# EasyEDA Pro project 残肢辅助输入设备.epro

# Schematic Schematic1_1
Board Name: Board1; Create Date: 2025-11-10; Page Name: P1; Project Name: 残值辅助输入设备; Schematic Name: Schematic1; Update Date: 2025-11-10; BladeWidth: 10; Company: 嘉立创EDA; Page Size: A4; RegionStart: 1; ShowBorder: 1; TitleBlock: 1; TitleBlockPosition: 3; Version: V1.0; XRegionCount: 6; YRegionCount: 4
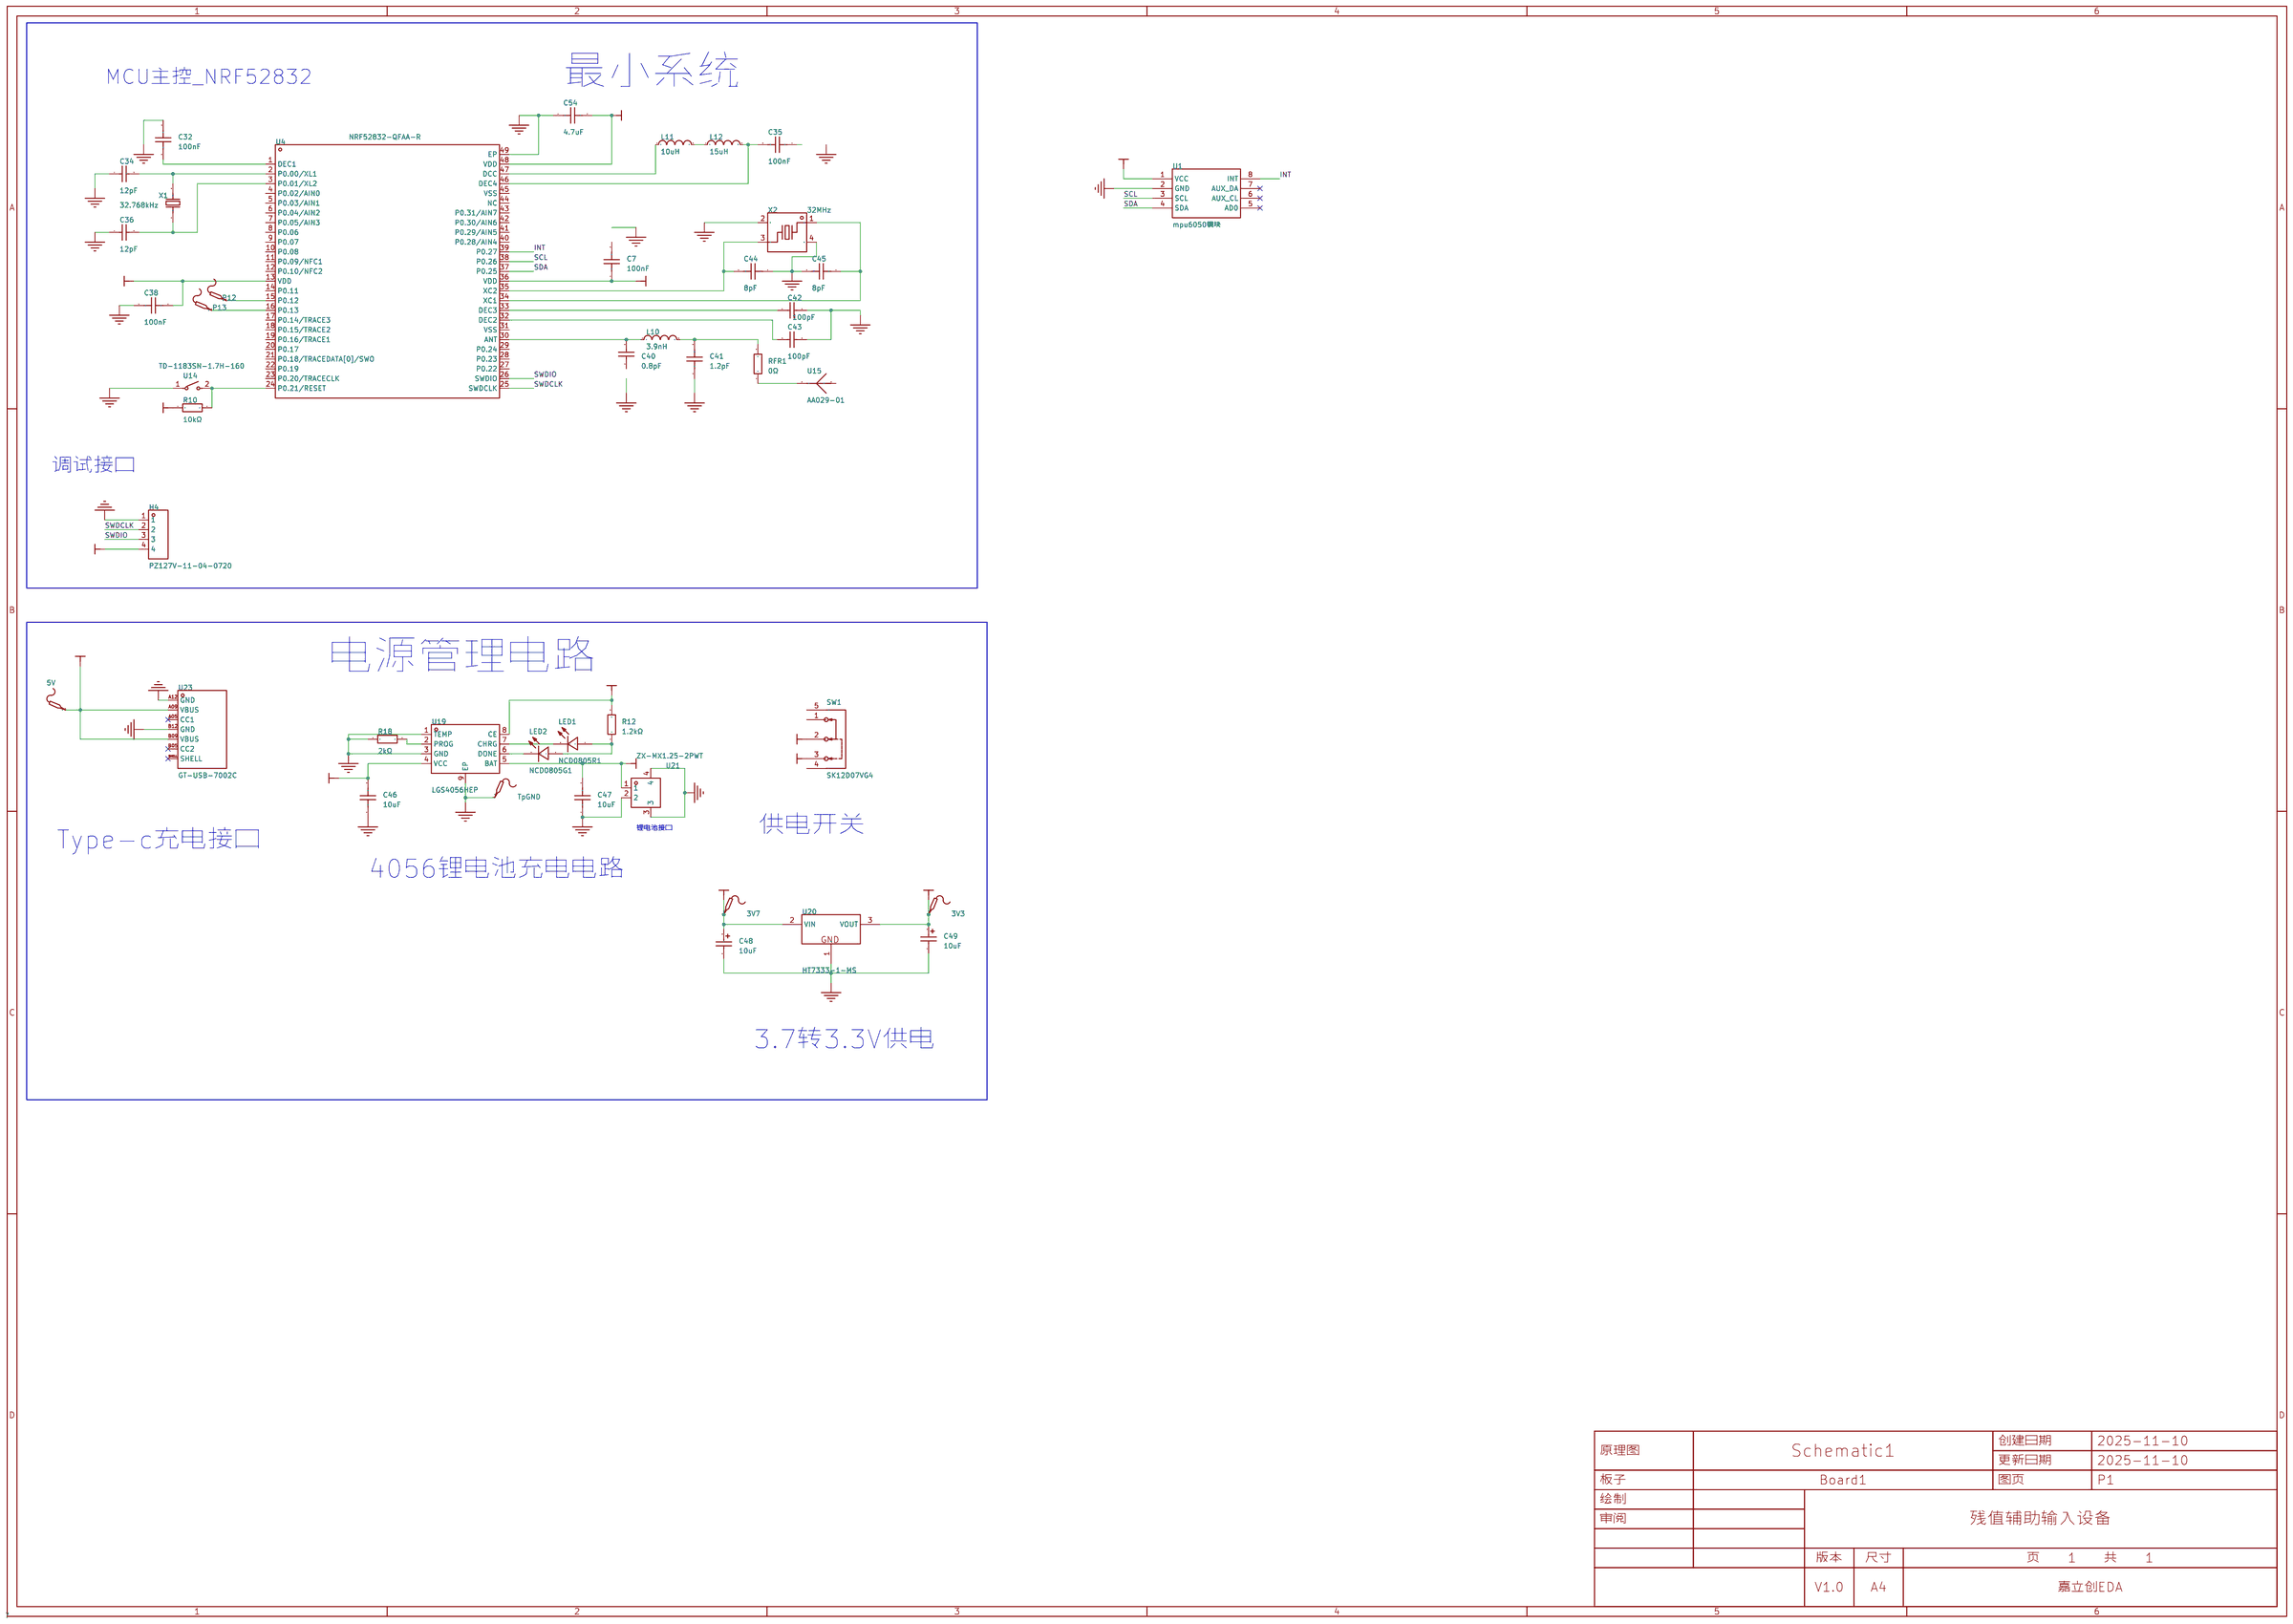
[diagram p0: schematic sheet]

## Parts
3V3  -  [Test-Point-0.5mm]
3V7  -  [Test-Point-0.5mm]
5V  -  [Test-Point-0.5mm]
C7  100nF  [C0402]
C32  100nF  [C0402]
C34  12pF  [C0402]
C35  100nF  [C0402]
C36  12pF  [C0402]
C38  100nF  [C0402]
C40  0.8pF  [C0402]
C41  1.2pF  [C0402]
C42  100pF  [C0402]
C43  100pF  [C0402]
C44  8pF  [C0402]
C45  8pF  [C0402]
C46  10uF  [C0603]
C47  10uF  [C0603]
C48  10uF  [CAP-SMD_L3.2-W1.6-RD]
C49  10uF  [CAP-SMD_L3.2-W1.6-RD]
C54  4.7uF  [C0402]
H4  PZ127V-11-04-0720  [HDR-TH_4P-P1.27-V-M]
L10  3.9nH  [L0603]
L11  10uH  [L0603]
L12  15uH  [L0603]
LED1  NCD0805R1  [LED0805-R-RD]
LED2  NCD0805G1  [LED0805-R-RD]
P12  -  [Test-Point-0.5mm]
P13  -  [Test-Point-0.5mm]
R10  10kΩ  [R0603]
R12  1.2kΩ  [R0603]
R18  2kΩ  [R0603]
RFR1  0Ω  [R0402]
SW1  SK12D07VG4  [SW-TH_SK12D07VG4]
TpGND  -  [Test-Point-0.5mm]
U1  mpu6050模块  [mpu6050模块]
U4  NRF52832-QFAA-R  [QFN-48_L6.0-W6.0-P0.40-BL-EP3.8]
U14  TD-1183SN-1.7H-160  [KEY-SMD_L3.0-W2.5-LS4.0_TD-1183SN]
U15  AA029-01  [ANT-SMD_L5.0-W2.2]
U19  LGS4056HEP  [ESOP-8_L4.9-W3.9-P1.27-LS6.0-BL-EP-1]
U20  HT7333-1-MS  [SOT-89-3_L4.5-W2.5-P1.50-LS4.2-BR]
U21  ZX-MX1.25-2PWT  [CONN-SMD_2P-P1.25_MEGASTAR_ZX-MX1.25-2PWT]
U23  GT-USB-7002C  [USB-C-SMD_GT-USB-7002C]
X1  32.768kHz  [FC-135R_L3.2-W1.5]
X2  32MHz  [CRYSTAL-SMD_4P-L2.0-W1.6-BL]

## Library data of the parts
3V3 3V7 5V P12 P13 TpGND = Test-Point: Test Point 测试点
C7 C32 C35 C38 = CL05B104KB54PNC: 容值:100nF;精度:±10%;额定电压:50V;材质(温度系数):X7R;; LCSC Part Name: 100nF ±10% 50V; Supplier Part: C307331; Manufacturer: SAMSUNG(三星); Supplier Footprint: 0402; JLCPCB Part Class: 基础库; Datasheet: https://atta.szlcsc.com/upload/public/pdf/source/20160218/1457707763339.pdf; Supplier: LCSC; Tolerance: ±10%; Voltage Rated: 50V; Temperature Coefficient: X7R
C34 C36 = 0402CG120J500NT: 容值:12pF;精度:±5%;额定电压:50V;温度系数:C0G;; LCSC Part Name: 12pF ±5% 50V; Supplier Part: C1547; Manufacturer: FH(风华); Supplier Footprint: 0402; JLCPCB Part Class: 基础库; Datasheet: https://item.szlcsc.com/datasheet/0402CG120J500NT/1899.html; Supplier: LCSC; Tolerance: ±5%; Voltage Rating: 50V; Temperature Coefficient: C0G
C40 = GJM1555C1HR80BB01D: 容值:0.8pF;额定电压:50V;温度系数:C0G;; LCSC Part Name: ±0.1pF 0.8pF 50V; Supplier Part: C76915; Manufacturer: muRata(村田); Supplier Footprint: 0402; JLCPCB Part Class: 扩展库; Datasheet: https://atta.szlcsc.com/upload/public/pdf/source/20180307/C76915_15204090825531407705.pdf; Supplier: LCSC; Voltage Rating: 50V; Temperature Coefficient: C0G
C41 = GJM1555C1H1R2BB01D: 容值:1.2pF;额定电压:50V;温度系数:-;; LCSC Part Name: ±0.1pF 1.2pF 50V; Supplier Part: C72135; Manufacturer: muRata(村田); Supplier Footprint: 0402; JLCPCB Part Class: 扩展库; Datasheet: https://atta.szlcsc.com/upload/public/pdf/source/20161108/1478586455030.pdf; Supplier: LCSC; Voltage Rating: 50V
C42 C43 = 0402CG101J500NT: 容值:100pF;精度:±5%;额定电压:50V;材质(温度系数):C0G;; LCSC Part Name: 100pF ±5% 50V; Supplier Part: C1546; Manufacturer: FH(风华); Supplier Footprint: 0402; JLCPCB Part Class: 基础库; Datasheet: https://atta.szlcsc.com/upload/public/pdf/source/20200305/C486355_26A10D38EF8C2A5C37091D0039909270.pdf; Supplier: LCSC; Tolerance: ±5%; Voltage Rated: 50V; Temperature Coefficient: C0G
C44 C45 = CC0402BRNPO9BN8R0: 容值:8pF;额定电压:50V;材质(温度系数):NP0;; LCSC Part Name: 8pF 50V ±0.1pF; Supplier Part: C281765; Manufacturer: YAGEO(国巨); Supplier Footprint: 0402; JLCPCB Part Class: 扩展库; Datasheet: https://atta.szlcsc.com/upload/public/pdf/source/20181008/C309499_21CC21451B82C39E3D92150FD6B30293.pdf; Supplier: LCSC; Voltage Rated: 50V; Temperature Coefficient: NP0
C46 C47 = CGA0603X5R106K100JT: 容值:10uF;精度:±10%;额定电压:10V;温度系数:X5R;; LCSC Part Name: 10uF ±10% 10V; Supplier Part: C6119842; Manufacturer: HRE(芯声); Supplier Footprint: 0603; JLCPCB Part Class: Extended Part; Supplier: LCSC; Tolerance: ±10%; Voltage Rating: 10V; Temperature Coefficient: X5R
C48 C49 = CA45-A-16V-10uF-K: 容值:10uF;精度:±10%;额定电压:16V;等效串联电阻:10Ω@100kHz;; LCSC Part Name: 10uF ±10% 16V; Supplier Part: C128254; Manufacturer: CEC(振华新云); Supplier Footprint: CASE-A-3216; JLCPCB Part Class: Extended Part; Datasheet: https://atta.szlcsc.com/upload/public/pdf/source/20170914/C128254_1505359752472967905.pdf; Supplier: LCSC; Tolerance: ±10%; Rated Voltage: 16V; Equivalent Series Resistance(ESR): 10Ω@100kHz; Operating Temperature: -55℃~+125℃
C54 = CL05A475MP5NRNC: 容值:4.7uF;精度:±20%;额定电压:10V;温度系数:X5R;; LCSC Part Name: 4.7uF ±20% 10V; Supplier Part: C23733; Manufacturer: SAMSUNG(三星); Supplier Footprint: 0402; JLCPCB Part Class: 基础库; Datasheet: https://item.szlcsc.com/datasheet/CL05A475MP5NRNC/24469.html; Supplier: LCSC; Tolerance: ±20%; Voltage Rating: 10V; Temperature Coefficient: X5R
H4 = PZ127V-11-04-0720: 插针结构:1x4P;间距:1.27mm;行距:-;圆针/方针:-;安装类型:直插;排数:单排;总PIN位数:4P;额定电流:-;额定电压:-;配合针长度:3.9mm;塑高:1mm;端接针长度:2.3mm;触头材质:黄铜;触头镀层:-;工作温度范围:-40℃~+105℃;焊接温度(最大值):-;颜色:黑色;; LCSC Part Name: 间距:1.27mm 1x4P 直插; Supplier Part: C541879; Manufacturer: XFCN(兴飞); Supplier Footprint: 插件,P=1.27mm; JLCPCB Part Class: 扩展库; Datasheet: https://atta.szlcsc.com/upload/public/pdf/source/20200519/C541879_5CD99C402ABEE613587AE88FBA356357.pdf; Supplier: LCSC; Pin Structure: 1x4P; Pitch: 1.27mm; Mounting Type: 直插; Number of Rows: 单排; Number of Pins: 4P; Length of Mating Pin: 3.9mm; Insulation Height: 1mm; Length of End Connection Pin: 2.3mm; Contact Material: 黄铜; Operating Temperature Range: -40℃~+105℃; Color: 黑色
L10 = SCC1608C3N9SSP: 电感值:3.9nH;额定电流:500mA;饱和电流(Isat):-;直流电阻(DCR):200mΩ;; Supplier Part: C412029; Manufacturer: Sunltech(顺磁); Supplier Footprint: 0603; JLCPCB Part Class: Extended Part; Datasheet: https://item.szlcsc.com/datasheet/SCC1608C3N9SSP/403522.html; Supplier: LCSC; Rated Current: 500mA; DC Resistance (DCR): 200mΩ; Current Rating: 500mA; DC Resistance(DCR): 200mΩ
L11 = MCL1608S100MT: 电感值:10uH;精度:±20%;额定电流:50mA;饱和电流(Isat):-;直流电阻(DCR):1.17Ω;; LCSC Part Name: 10uH ±20%; Supplier Part: C51942; Manufacturer: Sunlord(顺络); Supplier Footprint: 0603; JLCPCB Part Class: Extended Part; Datasheet: https://atta.szlcsc.com/upload/public/pdf/source/20241120/F98A73BCE98B3F58AF96E60C5F2B82D5.pdf; Supplier: LCSC; Tolerance: ±20%; Current Rating: 50mA; DC Resistance(DCR): 1.17Ω; Frequency - Self Resonant: 20MHz
L12 = MLF1608C150KTA00: 电感值:15uH;精度:±10%;额定电流:2mA;饱和电流(Isat):-;直流电阻(DCR):800mΩ;; LCSC Part Name: 15uH ±10%; Supplier Part: C275348; Manufacturer: TDK; Supplier Footprint: 0603; JLCPCB Part Class: Extended Part; Datasheet: https://atta.szlcsc.com/upload/public/pdf/source/20190108/C360705_7DAD0626EF1D2E0E828DA1C0F9238173.pdf; Supplier: LCSC; Tolerance: ±10%; Rated Current: 2mA; DC Resistance (DCR): 800mΩ; Q @ Freq: 20@1MHz; Frequency - Self Resonant: 22MHz
LED1 = NCD0805R1: 灯头类型:-;发光颜色:红色;正向电压(VF):1.6V~2.6V;功率:65mW;正向电流:20mA;主波长:615nm~630nm;二极管配置:独立二极管;透镜颜色:无色透明透镜;色温:-;发光强度:67mcd~195mcd;发光角度:130°;载带方式:-;工作温度:-30℃~+85℃;; Supplier Part: C84256; Manufacturer: 国星光电; Supplier Footprint: 0805; JLCPCB Part Class: Basic Part; Datasheet: https://atta.szlcsc.com/upload/public/pdf/source/20200820/C84256_F0A75A43B3EAD75808600A0514C76B99.pdf; Supplier: LCSC; Emitted Color: 红色; Forward Voltage (VF): 1.6V~2.6V; Power Dissipation: 65mW; Forward Current: 20mA; Dominant Wavelength: 615nm~630nm; Diode Configuration: 独立二极管; Lens Color: 无色透明透镜; Luminous Intensity: 67mcd~195mcd; Viewing Angle: 130°; Operating Temperature: -30℃~+85℃
LED2 = NCD0805G1: 灯头类型:-;发光颜色:绿色;正向压降(Vf):2.5V~3.6V;功率:72mW;正向电流:20mA;波长:525nm~537.5nm;二极管配置:-;透镜颜色:-;色温:-;发光强度:400mcd;发光角度:130°;载带方式:-;工作温度:-30℃~+85℃;; LCSC Part Name: 片式发光二极管; Supplier Part: C84260; Manufacturer: 国星光电; Supplier Footprint: 0805; JLCPCB Part Class: Extended Part; Datasheet: https://item.szlcsc.com/datasheet/NCD0805G1/85429.html; Supplier: LCSC; Illumination Color: 绿色; Voltage - Forward(Vf): 2.5V~3.6V; Power(Watts): 72mW; Forward Current: 20mA; Wavelength - Dominant: 525nm~537.5nm; Peak Wavelength: 520nm; Luminous Intensity: 400mcd; Viewing Angle: 130°; Operating Temperature: -30℃~+85℃
R10 = 0603WAF1002T5E: 电阻类型:厚膜电阻;阻值:10kΩ;精度:±1%;功率:100mW;最大工作电压:75V;温度系数:±100ppm/℃;; LCSC Part Name: 厚膜电阻 10kΩ ±1% 100mW; Supplier Part: C25804; Manufacturer: UNI-ROYAL(厚声); Supplier Footprint: 0603; JLCPCB Part Class: Basic Part; Datasheet: https://atta.szlcsc.com/upload/public/pdf/source/20200306/C422600_1E6D84923E4A46A82E41ADD87F860B5C.pdf; Supplier: LCSC; Type: 厚膜电阻; Tolerance: ±1%; Power(Watts): 100mW; Overload Voltage (Max): 75V; Temperature Coefficient: ±100ppm/℃; Operating Temperature Range: -55℃~+155℃
R12 = 0603WAF1201T5E: 电阻类型:厚膜电阻;阻值:1.2kΩ;精度:±1%;功率:100mW;工作电压:75V;温度系数:±100ppm/℃;; LCSC Part Name: 1.2kΩ ±1% 100mW 厚膜电阻; Supplier Part: C22765; Manufacturer: UNI-ROYAL(厚声); Supplier Footprint: 0603; JLCPCB Part Class: Basic Part; Datasheet: https://item.szlcsc.com/datasheet/0603WAF1201T5E/23492.html; Supplier: LCSC; Type: 厚膜电阻; Tolerance: ±1%; Power(Watts): 100mW; Voltage-Supply(Max): 75V; Temperature Coefficient: ±100ppm/℃; Operating Temperature: -55℃~+155℃
R18 = 0603WAF2001T5E: 电阻类型:厚膜电阻;阻值:2kΩ;精度:±1%;功率:100mW;工作电压:75V;温度系数:±100ppm/℃;; LCSC Part Name: 2kΩ ±1% 100mW 厚膜电阻; Supplier Part: C22975; Manufacturer: UNI-ROYAL(厚声); Supplier Footprint: 0603; JLCPCB Part Class: Basic Part; Datasheet: https://item.szlcsc.com/datasheet/0603WAF2001T5E/23702.html; Supplier: LCSC; Type: 厚膜电阻; Tolerance: ±1%; Power(Watts): 100mW; Voltage-Supply(Max): 75V; Temperature Coefficient: ±100ppm/℃; Operating Temperature: -55℃~+155℃
RFR1 = 0402WGF0000TCE: 电阻类型:厚膜电阻;阻值:0Ω;精度:±1%;功率:62.5mW;最大工作电压:50V;温度系数:±800ppm/℃;; LCSC Part Name: 0Ω ±1% 62.5mW 厚膜电阻; Supplier Part: C17168; Manufacturer: UNI-ROYAL(厚声); Supplier Footprint: 0402; JLCPCB Part Class: 基础库; Datasheet: https://atta.szlcsc.com/upload/public/pdf/source/20200306/C422600_1E6D84923E4A46A82E41ADD87F860B5C.pdf; Supplier: LCSC; Type: 厚膜电阻; Tolerance: ±1%; Power(Watts): 62.5mW; Overload Voltage (Max): 50V; Temperature Coefficient: ±800ppm/℃; Operating Temperature Range: -55℃~+155℃
SW1 = SK12D07VG4: 电路结构:单刀双掷;安装方式:-;额定电流:500mA;额定电压:50V;工作寿命:5千次;; LCSC Part Name: 3脚2档位 卧插 滑动开关; Supplier Part: C393937; Manufacturer: SHOU HAN(首韩); Supplier Footprint: 插件; JLCPCB Part Class: Extended Part; Datasheet: https://item.szlcsc.com/datasheet/SK12D07VG4/372549.html; Supplier: LCSC; Circuit: 单刀双掷; Actuator Style: 矩形柱状; Termination Style: PC引脚; Switch Height: 8.8mm; Current Rating: 500mA; Voltage Rating: 50V; Life: 5千次
U1 = mpu6050模块: 模块
U4 = NRF52832-QFAA-R: 频率范围:-;接口:I2C,SPI,UART;应用领域:IoT；蓝牙;数据速率:2Mbps;灵敏度:-96dBm;典型应用频率:2.4GHz;; Supplier Part: C77540; Manufacturer: NORDIC; Supplier Footprint: QFN-48-EP(6x6); JLCPCB Part Class: 扩展库; Datasheet: https://atta.szlcsc.com/upload/public/pdf/source/20191122/C77540_B22384C9419DF4416C7889F27174782C.pdf; Supplier: LCSC; Interface: I2C,SPI,UART; Operating Voltage: 1.7V~3.6V; Applications: IoT；蓝牙; Output Power: 4dBm; Data Rate: 2Mbps; Current Of Transmitting: 5.3mA; Sensitivity: -96dBm; Receive Current: 5.4mA; Typical Application Frequency: 2.4GHz; Operating Temperature: -40℃~+85℃
U14 = TD-1183SN-1.7H-160: LCSC Part Name: 小型正按轻触开关无柱 160gf H1.8; Supplier Part: C2905194; Manufacturer: DEALON(德艺隆); Supplier Footprint: SMD,2.5x3mm; Datasheet: https://atta.szlcsc.com/upload/public/pdf/source/20220901/772BB2D221624A1B1D046B52884053DD.pdf; Supplier: LCSC
U15 = AA029-01: LCSC Part Name: LXC(连兴创)AA029-陶瓷SMT天线; Supplier Part: C42379503; Manufacturer: LXC(连兴创); JLCPCB Part Class: 扩展库; Datasheet: https://atta.szlcsc.com/upload/public/pdf/source/20241122/407659FD5BCA78606BE7392D97FF646F.pdf; Supplier: LCSC
U19 = LGS4056HEP: 工作电压:4V~6V;最大充电电流:1A;电池类型:锂离子/聚合物;电池节数:1;; LCSC Part Name: TP4056H; Supplier Part: C5123970; Manufacturer: Legend-Si(棱晶半导体); Supplier Footprint: ESOP-8; JLCPCB Part Class: Extended Part; Datasheet: https://item.szlcsc.com/datasheet/LGS4056HEP/5718437.html; Supplier: LCSC; The Chip Type: 充电芯片; Voltage - Supply: 4V~6V; Charge Current - Max: 1A; Charging Saturation Voltage: 4.2V; Type of Battery: 锂离子/聚合物; Number of Cells: 1; Operating Temperature: -40℃~+85℃; Battery Temperature Detection: 支持; 0V Battery Charge: 支持; Supply Current (Iq): 150uA
U20 = HT7333-1-MS_C7434186: 输出类型:固定;工作电压:24V;输出电压:3.3V;输出电流:300mA;输出极性:正极;; LCSC Part Name: 低压差线性稳压器; Supplier Part: C7434186; Manufacturer: MSKSEMI(美森科); Supplier Footprint: SOT-89; JLCPCB Part Class: Extended Part; Datasheet: https://item.szlcsc.com/datasheet/HT7333-1-MS/8445362.html; Supplier: LCSC; Output Type: 固定; Voltage - Supply: 24V; Output Voltage: 3.3V; Output Current: 300mA; Voltage Dropout: 90mV@(40mA); standby current: 1.5uA; Operating Temperature: -35℃~+80℃@(Ta); Output Configuration: 正极; Number of Outputs: 1
U21 = ZX-MX1.25-2PWT: 插针结构:1x2P;间距:1.25mm;安装方式:卧贴;参考系列:PicoBlade(MX 1.25);总PIN数:2P;排数:1;每排PIN数:2;行距:-;额定电流:1A;触头材质:黄铜;触头镀层:锡;工作温度:-25℃~+85℃;; LCSC Part Name: 1x2P 间距:1.25mm 卧贴 系列:PicoBlade(MX 1.25); Supplier Part: C7430468; Manufacturer: Megastar(兆星); Supplier Footprint: SMD,P=1.25mm,卧贴; JLCPCB Part Class: Extended Part; Datasheet: https://item.szlcsc.com/datasheet/ZX-MX1.25-2PWT/8430337.html; Supplier: LCSC; Pins Structure: 1x2P; Pitch: 1.25mm; Mounting Type: 卧贴; Reference Series: PicoBlade(MX 1.25); Number of Pins: 2P; Number of Rows: 1; Number of PINs Per Row: 2; Current Rating: 1A; Contact Material: 黄铜; Contact Plating: 锡; Operating Temperature: -25℃~+85℃; Voltage Rating: 125V; Plastic Material: LCP; Supplementary Features: 辅助焊脚; Color: 米色; Z-Height of the Board: 3.6mm; X-Length of Bottom Edge on Board (Spacing Line): 7.5mm; Y-Width of Bottom Edge on Board: 5.25mm
U23 = GT-USB-7002C: 连接器类型:Type-C;协议标准:USB 2.0;公母:母;安装方式:卧贴;触点数量:6P;端口数量:1;额定电流 - 电源:-;工作温度:-40℃~+85℃;; LCSC Part Name: Type-C 母 卧贴; Supplier Part: C5117884; Manufacturer: G-Switch(品赞); Supplier Footprint: SMD; JLCPCB Part Class: Extended Part; Datasheet: https://item.szlcsc.com/datasheet/GT-USB-7002C/5694740.html; Supplier: LCSC; Connector Type: Type-C; Protocol Standard: USB 2.0; Gender: 母; Mounting Type: 卧贴; Number of Contacts: 6P; Number of Ports: 1; Connect-Disconnect Life: 1万次; Center Height: 1.65mm; Length: 6.8mm; Detection color: 黑色; Operating Temperature: -40℃~+85℃
X1 = Q13FC13500004_C32346: 晶振类型:贴片晶振;频率:32.768kHz;常温频差:±20ppm;负载电容:12.5pF;; LCSC Part Name: 32.768kHz ±20ppm 12.5pF; Supplier Part: C32346; Manufacturer: EPSON(爱普生); Manufacturer Part: Q13FC13500004; Supplier Footprint: SMD3215-2P; JLCPCB Part Class: 基础库; Datasheet: https://atta.szlcsc.com/upload/public/pdf/source/20240418/0E0FF5F0356BA3753F616001439D1416.pdf; Supplier: LCSC; Crystal Type: 贴片晶振; Normal temperature Frequency Tolerance: ±20ppm; Load Capacitor: 12.5pF; Equivalent Series Resistance (ESR): 70kΩ; Operating Temperature: -40℃~+85℃
X2 = XL7EL89CKI-111YLC-32M: 晶振类型:贴片晶振;频率:32MHz;常温频差:±10ppm;外接负载电容:8pF;频率稳定度(全温):±20ppm;; LCSC Part Name: 32MHz ±10ppm 8pF; Supplier Part: C2965582; Manufacturer: YXC(扬兴晶振); Supplier Footprint: SMD2016-4P; JLCPCB Part Class: 扩展库; Datasheet: https://atta.szlcsc.com/upload/public/pdf/source/20240329/C26C9A15A73CBCFBF373B30A8E126750.pdf; Supplier: LCSC; Crystal Type: 贴片晶振; Normal temperature Frequency Tolerance: ±10ppm; External load capacitor: 8pF; Frequency Stability(Full temperature range): ±20ppm; Operating Temperature: -40℃~+85℃

## Nets
GND: C7.2 C32.2 C34.1 C35.1 C36.1 C38.2 C40.1 C41.1 C42.2 C43.2 C44.1 C45.2 C46.1 C47.1 C48.2 C49.2 C54.1 H4.1 R18.1 TpGND.1 U1.2(GND) U4.31(VSS) U4.45(VSS) U4.49(EP) U14.1 U19.1(TEMP) U19.3(GND) U19.9(EP) U20.1(GND) U21.2 U21.3 U21.4 U23.A12(GND) U23.B12(GND) X2.2(GND) X2.4(GND)
VCC_3.3V: 3V3.1 C7.1 C38.1 C49.1 C54.2 H4.4 R10.1 U1.1(VCC) U4.13(VDD) U4.36(VDD) U4.48(VDD) U20.3(VOUT)
VCC_3.7V: 3V7.1 C48.1 SW1.3 U20.2(VIN)
VCC_5V_B+: 5V.1 C46.2 R12.2 U19.4(VCC) U19.8(CE) U23.A09(VBUS) U23.B09(VBUS)
B+: C47.2 SW1.2 U19.5(BAT) U21.1
INT: U1.8(INT) U4.39(P0.27)
SCL: U1.3(SCL) U4.38(P0.26)
SDA: U1.4(SDA) U4.37(P0.25)
SWDCLK: H4.2 U4.25(SWDCLK)
SWDIO: H4.3 U4.26(SWDIO)
$1N86: L11.2 L12.1
$1N87: C45.1 U4.34(XC1) X2.1
$1N89: C44.2 U4.35(XC2) X2.3
$1N101: RFR1.1 U15.1
$1N102: C41.2 L10.2 RFR1.2
$1N103: C40.2 L10.1 U4.30(ANT)
$1N106: C43.1 U4.32(DEC2)
$1N108: C42.1 U4.33(DEC3)
$1N113: C35.2 L12.2 U4.46(DEC4)
$1N114: L11.1 U4.47(DCC)
$1N118: R10.2 U4.24(P0.21/RESET) U14.2
$1N122: C36.2 U4.3(P0.01/XL2) X1.1
$1N124: C34.2 U4.2(P0.00/XL1) X1.2
$1N126: C32.1 U4.1(DEC1)
$1N149: R18.2 U19.2(PROG)
$1N153: LED2.2(K) U19.6(DONE)
$1N154: LED1.1(+) LED2.1(A) R12.1
$1N155: LED1.2(-) U19.7(CHRG)
$1N217: P12.1 U4.15(P0.12)
$1N218: P13.1 U4.16(P0.13)

Not connected (* = marked no-connect by the designer): SW1 1 4 5; U1 5(AD0)* 6(AUX_CL)* 7(AUX_DA)*; U4 4(P0.02/AIN0) 5(P0.03/AIN1) 6(P0.04/AIN2) 7(P0.05/AIN3) 8(P0.06) 9(P0.07) 10(P0.08) 11(P0.09/NFC1) 12(P0.10/NFC2) 14(P0.11) 17(P0.14/TRACE3) 18(P0.15/TRACE2) 19(P0.16/TRACE1) 20(P0.17) 21(P0.18/TRACEDATA[0]/SWO) 22(P0.19) 23(P0.20/TRACECLK) 27(P0.22) 28(P0.23) 29(P0.24) 40(P0.28/AIN4) 41(P0.29/AIN5) 42(P0.30/AIN6) 43(P0.31/AIN7) 44(NC); U15 2; U23 A05(CC1)* B05(CC2)* SHELL*

## Notes on the sheet
- MCU主控_NRF52832
- 最小系统
- 调试接口
- 电源管理电路
- 锂电池接口
- 供电开关
- Type-c充电接口
- 4056锂电池充电电路
- 3.7转3.3V供电

# Board PCB1_1
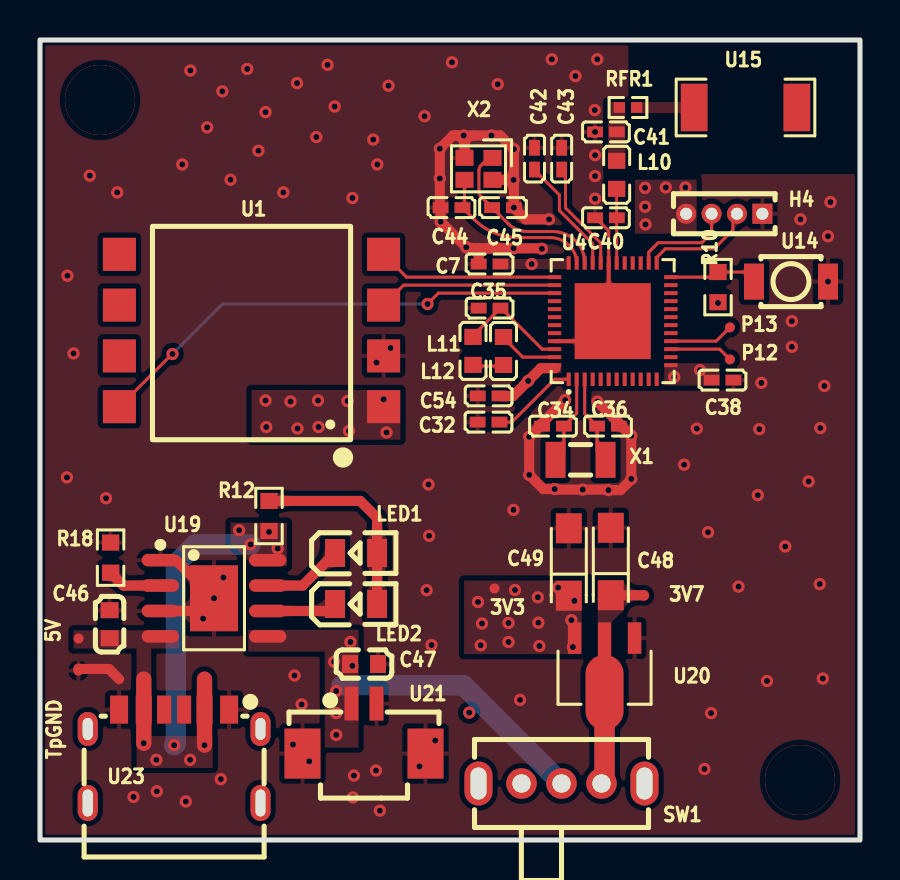
[diagram p1: board, top side]
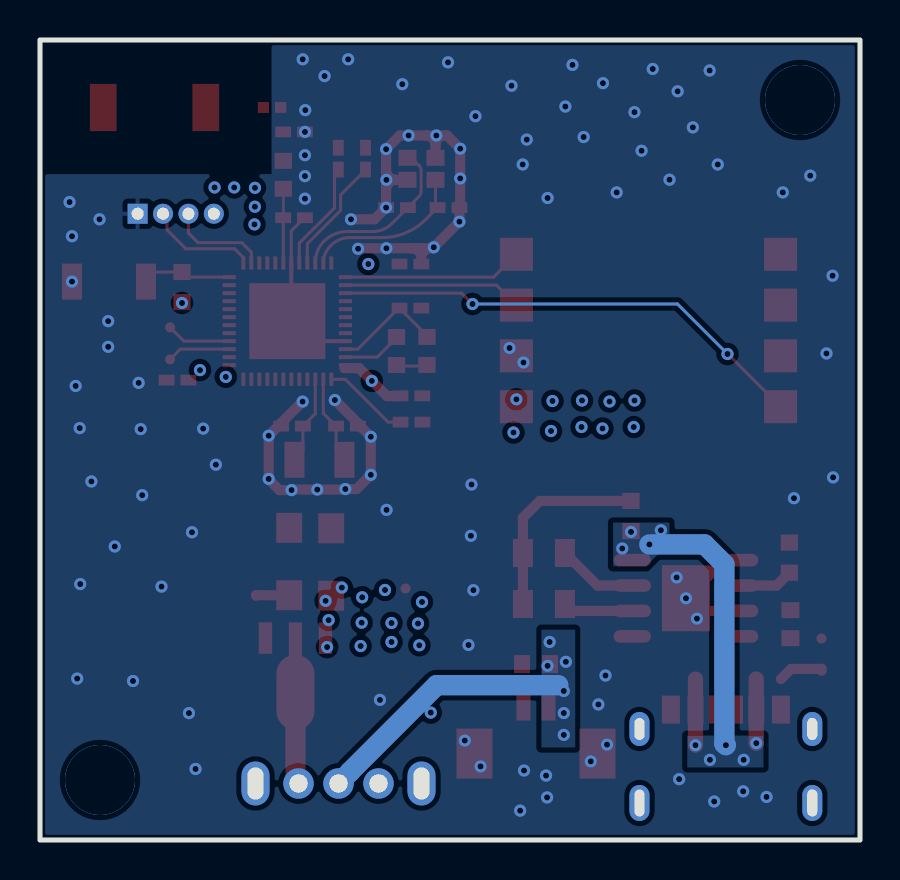
[diagram p2: board, bottom side, seen from below]

Outline 41 x 40 mm; copper layers: Top Layer, GND, PWR, Bottom Layer. Coordinates in mm from the lower left corner of the outline.
Outline path: rectangle 0,40 41,0
Stack: Top Layer 0.035mm Outer layer thickness 1oz / Dielectric1 0.2104mm 7628 RC49% 8.6mil / GND 0.0152mm Inner layer thickness / Dielectric2 1.065mm 1.1mm H/HOZ Copper / PWR 0.0152mm Inner layer thickness / Dielectric3 0.2104mm 7628 RC49% 8.6mil / Bottom Layer 0.035mm Outer layer thickness 1oz

## Design rules (mm)
spacing copperThickness1oz (default): track to track 0.152, other pairs 0.152 to 0.3
spacing copperThickness2oz: track to track 0.203, other pairs 0.152 to 0.3
track width copperThickness1oz (default): min 0.127, default 0.152, max 2.54
track width copperThickness2oz: min 0.203, default 0.254, max 2.54
differential pair differentialPair (default): width min 0.127, default 0.254, max 2.54; gap min 0.152, default 0.152
net GND uses copperRegion

## Placement (name value [footprint] x y rotation side)
3V3  -  [Test-Point-0.5mm]  22.72 12.58 90 top
3V7  -  [Test-Point-0.5mm]  30.2 12.22 90 top
5V  -  [Test-Point-0.5mm]  1.93 10.07 0 top
C7  100nF  [C0402]  22.48 28.8 180 top
C32  100nF  [C0402]  22.43 20.89 180 top
C34  12pF  [C0402]  25.65 20.69 0 top
C35  100nF  [C0402]  22.48 26.59 0 top
C36  12pF  [C0402]  28.4 20.69 180 top
C38  100nF  [C0402]  34.12 23 0 top
C40  0.8pF  [C0402]  28.3 31.11 0 top
C41  1.2pF  [C0402]  28.3 35.41 0 top
C42  100pF  [C0402]  24.73 34.07 90 top
C43  100pF  [C0402]  26.08 34.07 90 top
C44  8pF  [C0402]  20.57 31.62 0 top
C45  8pF  [C0402]  23.15 31.62 0 top
C46  10uF  [C0603]  3.48 10.79 270 top
C47  10uF  [C0603]  16.2 8.8 180 top
C48  10uF  [CAP-SMD_L3.2-W1.6-RD]  28.54 13.92 90 top
C49  10uF  [CAP-SMD_L3.2-W1.6-RD]  26.44 13.9 90 top
C54  4.7uF  [C0402]  22.43 22.21 0 top
H4  PZ127V-11-04-0720  [HDR-TH_4P-P1.27-V-M]  34.21 31.31 180 top
L10  3.9nH  [L0603]  28.83 33.26 90 top
L11  10uH  [L0603]  23.18 24.45 270 top
L12  15uH  [L0603]  21.65 24.46 90 top
LED1  NCD0805R1  [LED0805-R-RD]  15.8 14.35 0 top
LED2  NCD0805G1  [LED0805-R-RD]  15.8 11.8 0 top
P12  -  [Test-Point-0.5mm]  34.5 24.03 90 top
P13  -  [Test-Point-0.5mm]  34.5 25.63 90 top
R10  10kΩ  [R0603]  33.9 27.64 90 top
R12  1.2kΩ  [R0603]  11.45 16.2 270 top
R18  2kΩ  [R0603]  3.53 14.12 270 top
RFR1  0Ω  [R0402]  29.4 36.63 180 top
SW1  SK12D07VG4  [SW-TH_SK12D07VG4]  26.07 2.83 0 top
TpGND  -  [Test-Point-0.5mm]  1.92 8.46 0 top
U1  -  [mpu6050模块]  10.45 25.47 180 top
U4  NRF52832-QFAA-R  [QFN-48_L6.0-W6.0-P0.40-BL-EP3.8]  28.63 25.94 0 top
U14  TD-1183SN-1.7H-160  [KEY-SMD_L3.0-W2.5-LS4.0_TD-1183SN]  37.55 27.92 180 top
U15  AA029-01  [ANT-SMD_L5.0-W2.2]  35.28 36.63 0 top
U19  LGS4056HEP  [ESOP-8_L4.9-W3.9-P1.27-LS6.0-BL-EP-1]  8.7 12.09 270 top
U20  HT7333-1-MS  [SOT-89-3_L4.5-W2.5-P1.50-LS4.2-BR]  28.23 8.74 90 top
U21  ZX-MX1.25-2PWT  [CONN-SMD_2P-P1.25_MEGASTAR_ZX-MX1.25-2PWT]  16.2 5.57 180 top
U23  GT-USB-7002C  [USB-C-SMD_GT-USB-7002C]  6.71 4.19 0 top
X1  32.768kHz  [FC-135R_L3.2-W1.5]  27.03 19.01 180 top
X2  32MHz  [CRYSTAL-SMD_4P-L2.0-W1.6-BL]  21.93 33.56 180 top

## Footprints (pads in the part's own frame, mm; a bottom-side part is the same pattern mirrored in y, then rotated)
ANT-SMD_L5.0-W2.2
  rect 1.335x2.376 smd: 1(-2.567,0) 2(2.567,0)
C0402
  rect 0.79x0.54 smd: 1(-0.545,0) 2(0.545,0)
C0603
  rect 0.8x0.9 smd: 1(-0.7,0) 2(0.7,0)
CAP-SMD_L3.2-W1.6-RD
  rect 1.5x1.296 smd: 1(-1.687,0) 2(1.687,0)
CONN-SMD_2P-P1.25_MEGASTAR_ZX-MX1.25-2PWT
  rect 0.7x1.7 smd: 1(0.625,-1.25) 2(-0.625,-1.25)
  rect 1.8x2.5 smd: 3(-3.075,1.25) 4(3.075,1.25)
CRYSTAL-SMD_4P-L2.0-W1.6-BL
  rect 0.9x0.8 smd: 1(-0.7,-0.55) 2(0.7,-0.55) 3(0.7,0.55) 4(-0.7,0.55)
ESOP-8_L4.9-W3.9-P1.27-LS6.0-BL-EP-1
  oval 0.63x1.865 smd: 1(-1.905,-2.683) 2(-0.635,-2.683) 3(0.635,-2.683) 4(1.905,-2.683) 5(1.905,2.683) 6(0.635,2.683) 7(-0.635,2.683) 8(-1.905,2.683)
  rect 3.3x2.4 smd: 9(0,0)
FC-135R_L3.2-W1.5
  rect 1x1.8 smd: 1(-1.25,0) 2(1.25,0)
HDR-TH_4P-P1.27-V-M
  rect 1x1 hole 0.6: 1(-1.905,0)
  round 1 hole 0.6: 2(-0.635,0) 3(0.635,0) 4(1.905,0)
KEY-SMD_L3.0-W2.5-LS4.0_TD-1183SN
  rect 1x1.8 smd: 1(-1.85,0) 2(1.85,0)
L0603
  rect 0.8x0.864 smd: 1(-0.7,0) 2(0.7,0)
LED0805-R-RD
  rect 1x1.399 smd: 1(1.05,0) 2(-1.05,0)
mpu6050模块
  rect 1.651x1.651 smd: 1(-6.731,3.81) 2(-6.731,1.27) 3(-6.731,-1.27) 4(-6.731,-3.81) 5(6.479,-3.81) 6(6.479,-1.27) 7(6.479,1.27) 8(6.479,3.81)
QFN-48_L6.0-W6.0-P0.40-BL-EP3.8
  rect 0.2x0.665 smd: 1(-2.2,-2.908) 2(-1.8,-2.908) 3(-1.4,-2.908) 4(-1,-2.908) 5(-0.6,-2.908) 6(-0.2,-2.908) 7(0.2,-2.908) 8(0.6,-2.908) 9(1,-2.908) 10(1.4,-2.908) 11(1.8,-2.908) 12(2.2,-2.908) 25(2.2,2.908) 26(1.8,2.908) 27(1.4,2.908) 28(1,2.908) 29(0.6,2.908) 30(0.2,2.908) 31(-0.2,2.908) 32(-0.6,2.908) 33(-1,2.908) 34(-1.4,2.908) 35(-1.8,2.908) 36(-2.2,2.908)
  rect 0.665x0.2 smd: 13(2.908,-2.2) 14(2.908,-1.8) 15(2.908,-1.4) 16(2.908,-1) 17(2.908,-0.6) 18(2.908,-0.2) 19(2.908,0.2) 20(2.908,0.6) 21(2.908,1) 22(2.908,1.4) 23(2.908,1.8) 24(2.908,2.2) 37(-2.908,2.2) 38(-2.908,1.8) 39(-2.908,1.4) 40(-2.908,1) 41(-2.908,0.6) 42(-2.908,0.2) 43(-2.908,-0.2) 44(-2.908,-0.6) 45(-2.908,-1) 46(-2.908,-1.4) 47(-2.908,-1.8) 48(-2.908,-2.2)
  rect 3.8x3.8 smd: 49(0,0)
R0402
  rect 0.566x0.54 smd: 1(-0.433,0) 2(0.433,0)
R0603
  rect 0.806x0.864 smd: 1(-0.753,0) 2(0.753,0)
SOT-89-3_L4.5-W2.5-P1.50-LS4.2-BR
  rect 1.575x0.672 smd: 1(1.356,-1.5) 3(1.356,1.5)
  custom 5.377x1.9 smd: 2(-1.356,0)
SW-TH_SK12D07VG4
  round 1.524 hole 0.914: 1(-2,0) 2(0,0) 3(2,0)
  oval 1.4x2.2 hole 0.8x1.6: 4(4.15,0) 5(-4.15,0)
Test-Point-0.5mm
  round 0.5 smd: 1(0,0)
USB-C-SMD_GT-USB-7002C
  rect 0.7x1.4 smd: A05(-0.5,2.335) B05(0.5,2.335)
  rect 0.8x1.4 smd: A09(1.52,2.335) B09(-1.52,2.335)
  rect 0.9x1.4 smd: A12(2.75,2.335) B12(-2.75,2.335)
  oval 1x1.7 hole 0.5x1.1: SHELL(-4.32,1.365) SHELL(4.32,1.365)
  oval 1x1.8 hole 0.5x1.35: SHELL(-4.32,-2.335) SHELL(4.32,-2.335)

## Nets
As in the schematic.

Pads without a net: SW1 1 4 5; U1 5 6 7; U4 4 5 6 7 8 9 10 11 12 14 17 18 19 20 21 22 23 27 28 29 40 41 42 43 44; U15 2; U23 A05 B05 SHELL

## Via types
v1: diameter 3.5, hole 3.5, Top Layer to Bottom Layer, 2 vias
v2: diameter 0.61, hole 0.305, Top Layer to Bottom Layer, 153 vias

## Routing (per net, layer and track width the routed paths; a pad name or vN(x,y) marks a point on that pad's centre or on a via; arc(x,y) is an arc through that point)
GND: length 58.2
  Top Layer w0.152: 28.13,25.44 U4.49 ; 27.75,31.14 28.44,30.46 28.44,28.85
  Top Layer w0.203: 28.44,28.85 28.44,26.14 U4.49 ; 28.13,25.44 27.63,24.94 U4.45
  Top Layer w0.508: 21.94,29.59 22.46,29.59 ; 21.94,29.59 21.57,29.59 ; 21.94,29.59 21.93,29.58 21.93,29.3 ; 22.46,29.59 v2(23.68,29.59) 25.07,29.59 v2(25.09,29.56) ; 22.46,29.59 arc(22.24,29.54) 22.05,29.42 21.93,29.3 ; 1.92,8.57 1.93,8.55 3.45,8.55 3.96,8.05 ; v2(21.31,29.64) v2(20.03,30.92) C44.1 19.99,31.66 v2(19.99,33.08) v2(19.99,34.56) 20.65,35.22 20.76,35.22 ; v2(21.31,29.64) 21.36,29.59 21.57,29.59 ; v2(21.31,29.64) arc(21.44,29.62) 21.57,29.59 ; X2.2 21.23,34.76 ; 21.23,34.76 21.23,35.18 v2(21.18,35.22) ; 21.23,34.76 arc(21.26,34.93) 21.35,35.07 arc(21.5,35.19) 21.69,35.22 ; 21.23,34.76 arc(21.19,34.95) 21.07,35.1 arc(20.93,35.19) 20.76,35.22 ; 21.57,29.59 arc(21.69,29.52) 21.8,29.43 21.93,29.3 ; v2(26.26,22) 25.1,20.84 C34.1 25.08,20.72 25.02,20.72 v2(24.46,20.16) v2(24.46,18.26) 25.17,17.55 v2(25.73,17.55) 25.76,17.52 v2(27.14,17.52) 28.4,17.52 v2(28.42,17.5) 29.03,17.5 29.57,18.03 v2(29.57,18.05) v2(29.57,20.21) 29.08,20.69 C36.1 28.94,20.84 v2(27.87,21.92) ; 21.69,35.22 v2(22.57,35.22) 23.01,35.22 v2(23.69,34.54) 23.69,33.49 ; 21.69,35.22 v2(21.18,35.22) ; 21.93,29.3 C7.2 ; 23.21,33.01 v2(23.68,33.01) 23.69,33.02 ; 23.21,33.01 X2.4 ; 23.21,33.01 arc(23.39,33.04) 23.55,33.14 arc(23.66,33.3) 23.69,33.49 ; 23.21,33.01 arc(23.39,32.97) 23.55,32.87 arc(23.66,32.71) 23.69,32.53 ; v2(21.18,35.22) 20.76,35.22 ; 23.69,33.49 23.69,33.02 ; 23.69,33.02 23.69,32.53 ; 23.69,32.53 v2(23.69,31.62) 24.28,31.03 v2(25.45,31.03) ; U19.3 8.07,11.45 v2(8.7,12.09) 6.8,13.99 U19.1
  vias: v2(1.35,18.13) v2(1.37,28.21) v2(1.68,24.33) v2(2.49,33.22) v2(3.3,17.09) v2(3.86,32.38) v2(4.67,2.15) v2(5.84,2.43) v2(7.11,33.78) v2(7.29,1.93) v2(7.52,38.48) v2(8.15,11.07) v2(8.36,35.63) v2(9.04,3.04) v2(9.12,37.43) v2(9.17,13.13) v2(9.53,33.02) v2(10.36,38.55) v2(10.92,34.46) v2(11.28,36.39) v2(12.17,32.38) v2(12.65,4.77) v2(12.73,8.22) v2(12.85,37.84) v2(13.08,6.78) v2(13.46,3.93) v2(13.82,35.15) v2(14.38,38.76) v2(14.73,36.67) v2(15.62,32.1) v2(15.65,2.13) v2(15.7,3.22) v2(16.66,35.02) v2(16.82,23.88) v2(16.8,3.47) v2(16.87,33.78) v2(16.99,1.47) v2(17.42,37.71) v2(17.53,24.6) v2(18.97,3.68) v2(19.23,36.19) v2(19.33,12.49) v2(19.43,17.78) v2(19.46,15.21) v2(19.57,9.75) v2(19.76,4.97) v2(20.6,38.88) v2(22.89,37.79) v2(23.67,16.5) v2(24,7.01) v2(25.59,39.03) v2(26.77,38.2) v2(27.74,36.5) v2(27.75,35.41) v2(27.75,34.24) v2(27.75,33.19) v2(27.75,32.07) v2(27.86,39.03) v2(32.21,18.77) v2(32.84,20.57) v2(33.22,3.55) v2(33.4,15.39) v2(33.55,6.34) v2(34.93,12.67) v2(35.89,17.24) v2(35.97,20.54) v2(36.07,22.86) v2(36.35,7.95) v2(37.26,14.68) v2(37.59,25.94) v2(37.59,24.66) v2(38.02,31.03) v2(38.43,17.93) v2(39.01,20.59) v2(38.99,12.8) v2(39.14,8.07) v2(39.22,22.7) v2(39.4,30.19) v2(39.4,27.92) v2(39.52,31.9)
VCC_3.3V: length 3.4
  Top Layer w0.508: 23,22.19 23.65,22.19 v2(24.41,22.96) 25.04,23.59 25.78,23.59
  vias: v2(11.28,21.97) v2(11.31,20.65) v2(12.53,21.92) v2(12.88,20.58) v2(13.9,21.97) v2(13.93,20.65) v2(15.38,21.95) v2(15.45,20.45) v2(17.18,22.03) v2(17.32,20.38) v2(21.9,11.9) v2(22.03,9.74) v2(22.1,10.83) v2(23.43,10.85) v2(23.43,9.9) v2(23.75,12.5) v2(24.58,28.8) v2(24.89,12.14) v2(24.92,10.87) v2(24.97,9.7) v2(25.91,12.62) v2(26.57,10.99) v2(26.64,9.65) v2(26.72,11.96) v2(30.25,32.61) v2(30.26,31.66) v2(30.28,30.78) v2(31.29,32.63) v2(31.71,23.15) v2(32.27,32.63) v2(33,23.49) v2(33.9,26.85)
VCC_3.7V: length 6.3
  Top Layer w0.508: 3V7.1 30.19,12.24 28.54,12.24
  Top Layer w1.016: 28.23,7.38 28.23,2.98 SW1.3
VCC_5V_B+: length 19.8
  Top Layer w0.762: v2(8.23,4.74) U23.A09 8.23,8.05 ; 5.19,8.05 5.19,4.85 v2(5.19,4.84)
  Bottom Layer w1.016: v2(10.53,14.78) 7.77,14.78 6.78,13.79 6.78,4.82 v2(6.71,4.74)
  vias: v2(5.82,4.01) v2(7.5,4.01) v2(9.96,15.49) v2(11.45,15.41) v2(11.89,14.57)
(no net):
  vias: v1(3,37) v1(38,3)
B+: length 13
  Bottom Layer w1.016: 15.09,7.74 21.17,7.74 25.5,3.41 25.5,3.4 SW1.2
  vias: v2(14.71,8.91) v2(14.81,7.45) v2(14.81,6.35) v2(14.81,5.25) v2(15.52,9.9) v2(15.62,8.71) v2(21.46,6.37)
INT: length 24.1
  Top Layer w0.152: 3.97,21.67 6.61,24.3 v2(6.62,24.3) ; v2(19.38,26.8) 19.92,27.34 U4.39
  Bottom Layer w0.152: v2(6.62,24.3) 9.12,26.8 v2(19.38,26.8)
SCL: length 9
  Top Layer w0.152: U4.38 18.18,27.74 U1.3
SDA: length 9
  Top Layer w0.152: U4.37 18.32,28.14 U1.4
SWDCLK: length 5.1
  Top Layer w0.152: 34.8,31.14 34.65,30.98 34.65,30.5 33.71,29.56 31.27,29.56 30.81,29.1
SWDIO: length 5
  Top Layer w0.152: 30.44,28.85 30.44,29.39 30.91,29.87 33.1,29.87 33.58,30.35 H4.3
$1N86: length 1.6
  Top Layer w0.152: 23.2,23.68 23.19,23.69 21.65,23.69
$1N87: length 9.1
  Top Layer w0.152: U4.34 27.23,28.89 arc(27.12,29.46) 26.8,29.94 arc(26.26,30.3) 25.63,30.42 24.36,30.42 arc(23.84,30.53) 23.41,30.82 22.05,32.17 arc(21.97,32.29) 21.95,32.43 21.95,33.48 arc(21.97,33.61) 22.05,33.73 22.29,33.97 arc(22.44,34.07) X2.1
$1N89: length 8.3
  Top Layer w0.152: X2.3 21.23,31.88 arc(21.2,31.74) C44.2 21.71,31.03 arc(22.72,30.36) 23.91,30.12 25.52,30.12 arc(26.02,30.02) 26.44,29.74 26.49,29.69 arc(26.74,29.31) U4.35
$1N103: length 3.7
  Top Layer w0.142: U4.30 28.83,31.1 C40.2 28.83,31.12 L10.1
$1N106: length 5.6
  Top Layer w0.152: 26.27,33.41 26.27,33.33 ; 26.27,33.33 26.27,31.6 27.26,30.61 27.27,30.61 28.03,29.85 28.03,28.85 ; 26.27,33.33 C43.1
$1N108: length 5.9
  Top Layer w0.152: U4.33 27.63,29.81 25.97,31.48 25.97,32.25 24.7,33.52
$1N113: length 5.7
  Top Layer w0.152: 21.65,25.09 21.65,25.22 22.97,26.54 ; 22.97,26.59 22.97,26.54 ; 22.97,26.54 22.97,26.48 23.17,26.48 25.11,24.54 25.73,24.54 ; 22.97,26.54 C35.2
$1N114: length 2.9
  Top Layer w0.152: U4.47 24.14,24.14 23.2,25.08
$1N118: length 4.5
  Top Layer w0.152: U14.2 35.22,28.4 R10.2 33.65,28.14 U4.24
$1N122: length 4.5
  Top Layer w0.152: U4.3 27.23,21.31 C36.2 27.85,19.43 X1.1
$1N124: length 4.5
  Top Layer w0.152: U4.2 26.83,21.34 C34.2 26.19,19.43 X1.2
$1N126: length 4.4
  Top Layer w0.152: C32.1 23.59,20.89 25.73,23.04 26.44,23.04
$1N149: length 2.8
  Top Layer w0.508: R18.2 4.17,12.72 U19.2
$1N153: length 3.5
  Top Layer w0.508: LED2.2 14.41,11.45 U19.6
$1N154: length 10.1
  Top Layer w0.508: LED2.1 LED1.1 16.85,16.11 16.01,16.95 R12.1
$1N155: length 4
  Top Layer w0.508: LED1.2 13.13,12.72 U19.7
$1N217: length 3.2
  Top Layer w0.152: 31.54,24.54 33.98,24.54 P12.1
$1N218: length 3.2
  Top Layer w0.152: P13.1 33.81,24.94 U4.16

## Copper pours and planes (outline as drawn; the poured copper is in the pictures)
GND on Top Layer: -5.51,42.97 46.35,42.97 46.35,-3.89 -5.51,-3.89
GND on Bottom Layer: -4.27,44.06 44.63,44.06 44.63,-1.73 -4.27,-1.73
GND on GND: 0.26,39.74 40.74,39.74 40.74,0.26 0.26,0.26
GND on PWR: 0.26,19.73 40.74,19.73 40.74,0.26 0.26,0.26
GND on PWR: 0.26,39.74 29.42,39.74 29.42,33.42 0.26,33.42
VCC_3.3V on Top Layer: 22.63,29.05 26.53,29.05 26.53,28.54 22.63,28.54
VCC_3.3V on Top Layer: 29.74,33.02 32.84,33.02 32.84,30.31 29.74,30.31
VCC_3.3V on Top Layer: 21.21,12.97 27.08,12.97 27.08,9.29 21.21,9.29
VCC_3.3V on Top Layer: 31.21,23.84 33.98,23.84 33.98,22.72 31.21,22.72
VCC_3.3V on Top Layer: 10.58,22.5 18.03,22.5 18.03,20.01 10.58,20.01
VCC_3.3V on PWR: 0.26,33.16 40.74,33.16 40.74,8.91 0.26,8.91
VCC_3.7V on Top Layer: 27.89,12.97 29.18,12.97 29.18,9.32 27.89,9.32
VCC_5V_B+ on Top Layer: 9.53,15.87 12.34,15.87 12.34,13.69 9.53,13.69
VCC_5V_B+ on Top Layer: 4.83,5.19 8.64,5.19 8.64,3.6 4.83,3.6
VCC_5V_B+ on Top Layer: 1.68,10.48 6.96,10.48 6.96,6.42 1.68,6.42
VCC_5V_B+ on Bottom Layer: 9.53,15.87 12.34,15.87 12.34,13.69 9.53,13.69
VCC_5V_B+ on Bottom Layer: 4.83,5.22 8.64,5.22 8.64,3.63 4.83,3.63
B+ on Top Layer: 10.41,10.51 15.93,10.51 15.93,4.62 10.41,4.62
B+ on Bottom Layer: 14.24,10.52 15.93,10.52 15.93,4.62 14.24,4.62
$1N101 on Top Layer: 29.55,36.89 32.18,36.89 32.18,36.34 29.55,36.34
$1N102 on Top Layer: 28.4,36.9 29.26,36.9 29.26,33.6 28.4,33.6

Small or netless copper shapes (teardrops, artwork), in the pictures only: 115 on Top Layer, 3 on GND, 3 on PWR
